# Altium schematic sheet wisp-5-main.SchDoc
size A
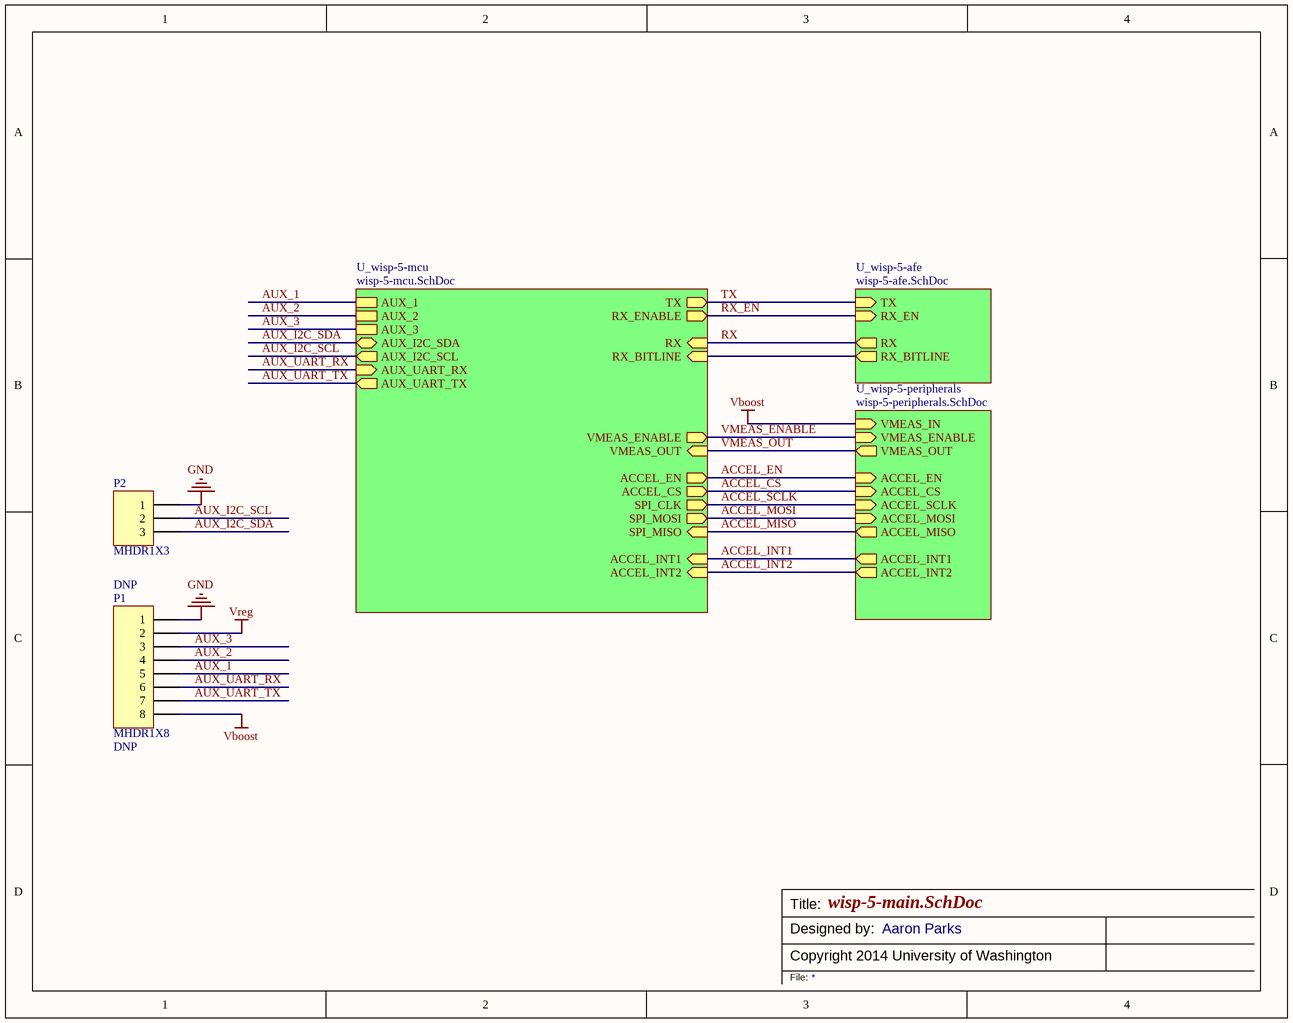
[diagram p0: wisp-5-main.SchDoc]

## Parts
P1  MHDR1X8  [MHDR1X8]
P2  MHDR1X3  [MHDR1X3]

## Sub-sheets
U_wisp-5-afe = wisp-5-afe.SchDoc: TX (in), RX_EN (in), RX (out), RX_BITLINE (out)
U_wisp-5-mcu = wisp-5-mcu.SchDoc: RX (in), ACCEL_INT1 (in), ACCEL_INT2 (in), TX (out), RX_ENABLE (out), VMEAS_ENABLE (out), ACCEL_CS (out), SPI_MOSI (out), SPI_MISO (in), SPI_CLK (out), AUX_I2C_SCL (out), AUX_I2C_SDA (bidir), VMEAS_OUT (in), ACCEL_EN (out), AUX_UART_TX (out), AUX_UART_RX (in), AUX_1, AUX_2, AUX_3, RX_BITLINE (in)
U_wisp-5-peripherals = wisp-5-peripherals.SchDoc: VMEAS_IN (in), VMEAS_OUT (out), VMEAS_ENABLE (in), ACCEL_INT1 (out), ACCEL_INT2 (out), ACCEL_SCLK (in), ACCEL_MOSI (in), ACCEL_MISO (out), ACCEL_CS (in), ACCEL_EN (in)

## Nets
GND: P1.1 P2.1
Vboost: P1.8 ; sheet U_wisp-5-peripherals/VMEAS_IN
Vreg: P1.2
ACCEL_CS: sheet U_wisp-5-mcu/ACCEL_CS, sheet U_wisp-5-peripherals/ACCEL_CS
ACCEL_EN: sheet U_wisp-5-mcu/ACCEL_EN, sheet U_wisp-5-peripherals/ACCEL_EN
ACCEL_INT1: sheet U_wisp-5-mcu/ACCEL_INT1, sheet U_wisp-5-peripherals/ACCEL_INT1
ACCEL_INT2: sheet U_wisp-5-mcu/ACCEL_INT2, sheet U_wisp-5-peripherals/ACCEL_INT2
ACCEL_MISO: sheet U_wisp-5-mcu/SPI_MISO, sheet U_wisp-5-peripherals/ACCEL_MISO
ACCEL_MOSI: sheet U_wisp-5-mcu/SPI_MOSI, sheet U_wisp-5-peripherals/ACCEL_MOSI
ACCEL_SCLK: sheet U_wisp-5-mcu/SPI_CLK, sheet U_wisp-5-peripherals/ACCEL_SCLK
AUX_1: P1.5 ; sheet U_wisp-5-mcu/AUX_1
AUX_2: P1.4 ; sheet U_wisp-5-mcu/AUX_2
AUX_3: P1.3 ; sheet U_wisp-5-mcu/AUX_3
AUX_I2C_SCL: P2.2 ; sheet U_wisp-5-mcu/AUX_I2C_SCL
AUX_I2C_SDA: P2.3 ; sheet U_wisp-5-mcu/AUX_I2C_SDA
AUX_UART_RX: P1.6 ; sheet U_wisp-5-mcu/AUX_UART_RX
AUX_UART_TX: P1.7 ; sheet U_wisp-5-mcu/AUX_UART_TX
RX: sheet U_wisp-5-mcu/RX, sheet U_wisp-5-afe/RX
RX_EN: sheet U_wisp-5-mcu/RX_ENABLE, sheet U_wisp-5-afe/RX_EN
TX: sheet U_wisp-5-mcu/TX, sheet U_wisp-5-afe/TX
VMEAS_ENABLE: sheet U_wisp-5-mcu/VMEAS_ENABLE, sheet U_wisp-5-peripherals/VMEAS_ENABLE
VMEAS_OUT: sheet U_wisp-5-mcu/VMEAS_OUT, sheet U_wisp-5-peripherals/VMEAS_OUT
(unnamed): sheet U_wisp-5-mcu/RX_BITLINE, sheet U_wisp-5-afe/RX_BITLINE

## Notes on the sheet
- Title:
- Copyright 2014 University of Washington
- Designed by:
- Aaron Parks
- File:

## Library data of the parts
P1 = MHDR1X8: Header, 8-Pin; DNP: DNP
P2 = MHDR1X3: Header, 3-Pin; DNP: DNP